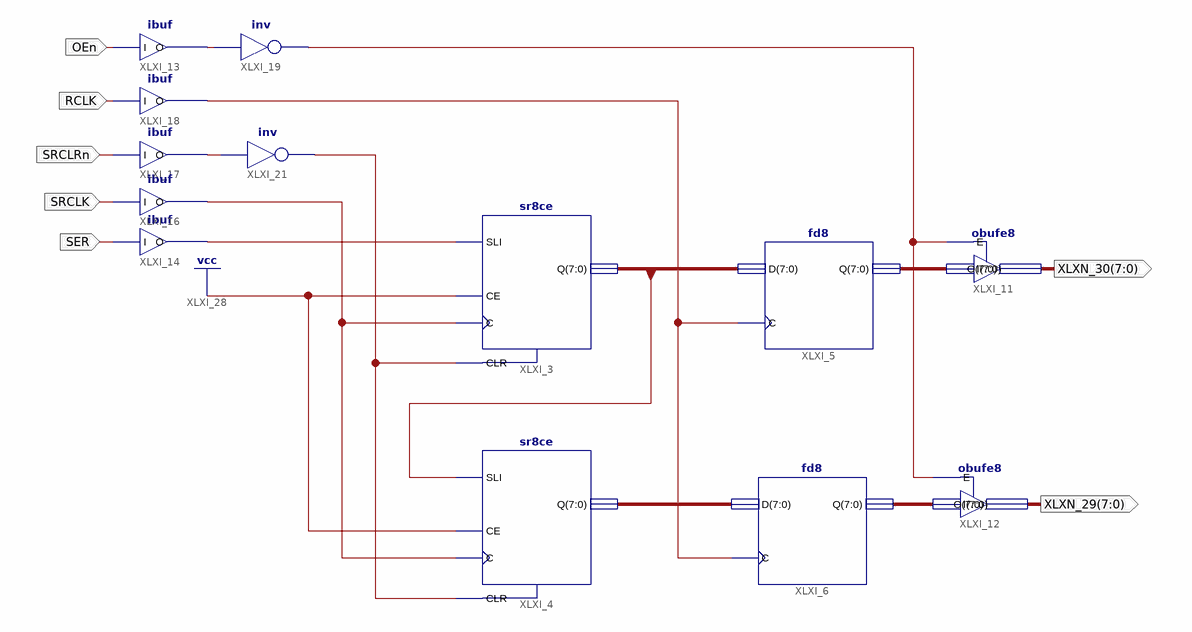
[diagram p0: schematic sheet 1]
// Xilinx ISE schematic Dual595s.sch (xbr) as structural Verilog: 13 symbols, 7 ports
module Dual595s (
  input  SER,
  input  OEn,
  input  RCLK,
  input  SRCLRn,
  input  SRCLK,
  output [7:0] XLXN_29,
  output [7:0] XLXN_30
);

  wire XLXN_3, XLXN_5, XLXN_6, XLXN_22, XLXN_31, XLXN_32, XLXN_40;
  wire [7:0] XLXN_1, XLXN_2, XLXN_18, XLXN_19;

  sr8ce XLXI_4 (.C(XLXN_6), .CE(1'b1), .CLR(XLXN_5), .SLI(XLXN_1[7]), .Q(XLXN_2));
  fd8 XLXI_6 (.C(XLXN_3), .D(XLXN_2), .Q(XLXN_19));
  sr8ce XLXI_3 (.C(XLXN_6), .CE(1'b1), .CLR(XLXN_5), .SLI(XLXN_22), .Q(XLXN_1));
  fd8 XLXI_5 (.C(XLXN_3), .D(XLXN_1), .Q(XLXN_18));
  obufe8 XLXI_11 (.E(XLXN_32), .I(XLXN_18), .O(XLXN_30));
  obufe8 XLXI_12 (.E(XLXN_32), .I(XLXN_19), .O(XLXN_29));
  ibuf XLXI_14 (.I(SER), .O(XLXN_22));
  not XLXI_19 (XLXN_32, XLXN_31);
  ibuf XLXI_13 (.I(OEn), .O(XLXN_31));
  ibuf XLXI_18 (.I(RCLK), .O(XLXN_3));
  ibuf XLXI_17 (.I(SRCLRn), .O(XLXN_40));
  not XLXI_21 (XLXN_5, XLXN_40);
  ibuf XLXI_16 (.I(SRCLK), .O(XLXN_6));
endmodule
